# Altium schematic sheet Sche_PheriperalSchDoc.SchDoc
size A
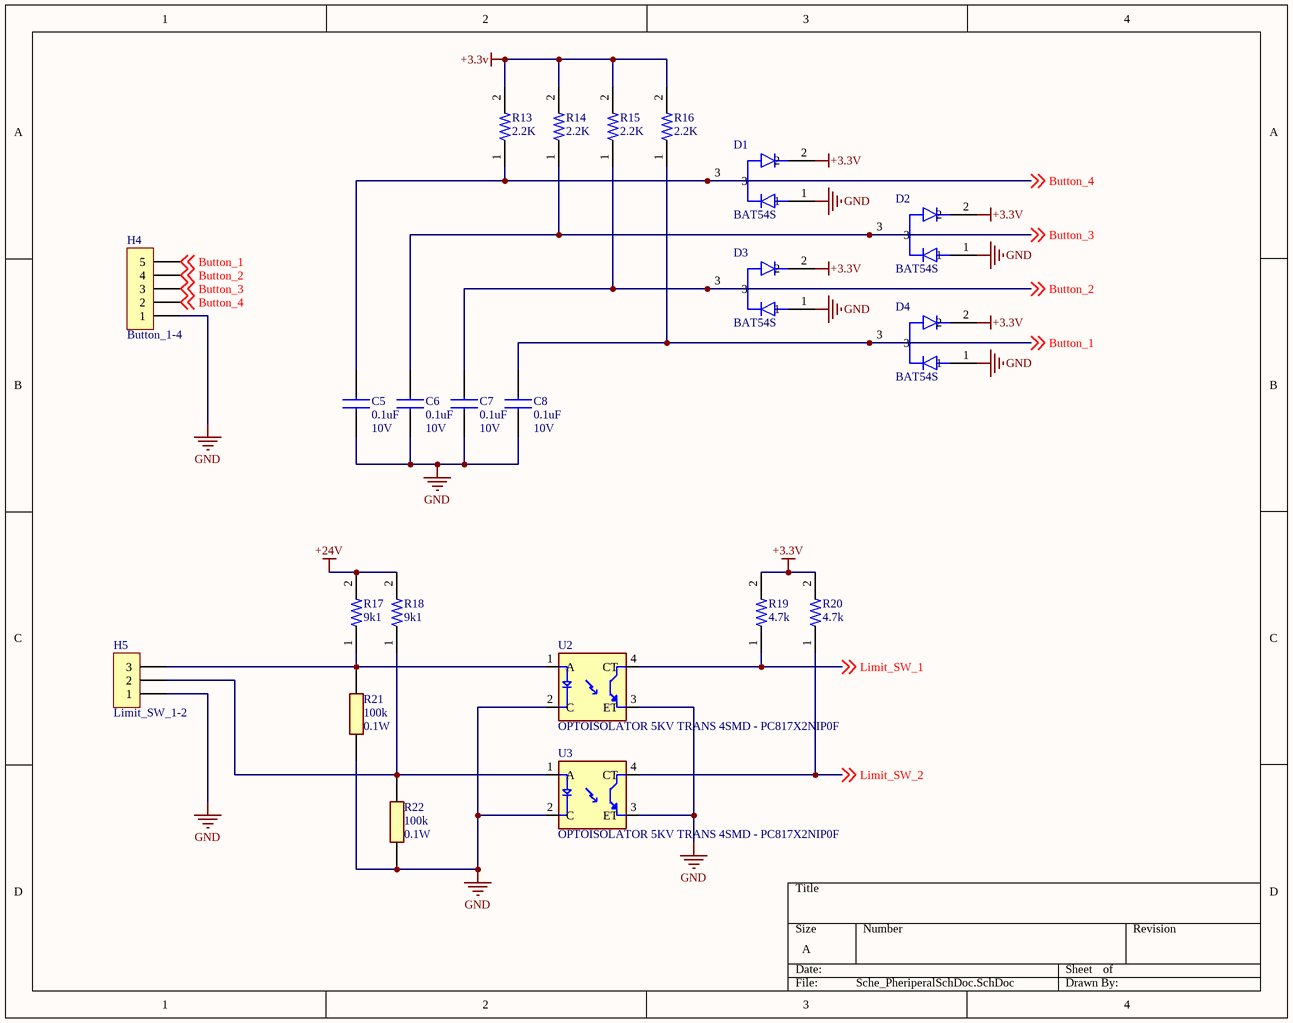
[diagram p0: Sche_PheriperalSchDoc.SchDoc]

## Parts
C5  0.1uF  [CAPC1608X95N]
C6  0.1uF  [CAPC1608X95N]
C7  0.1uF  [CAPC1608X95N]
C8  0.1uF  [CAPC1608X95N]
D1  BAT54S  [SOT95P240X120-3N]
D2  BAT54S  [SOT95P240X120-3N]
D3  BAT54S  [SOT95P240X120-3N]
D4  BAT54S  [SOT95P240X120-3N]
H4  Button_1-4  [Header 5P DC 2.54]
H5  Limit_SW_1-2  [Header 3P DC 2.54]
R13  2.2K  [RES 0805]
R14  2.2K  [RES 0805]
R15  2.2K  [RES 0805]
R16  2.2K  [RES 0805]
R17  9k1  [Res 0603]
R18  9k1  [Res 0603]
R19  4.7k  [Res 0603]
R20  4.7k  [Res 0603]
R21  100k  [ERJ2RKD1004X]
R22  100k  [ERJ2RKD1004X]
U2  OPTOISOLATOR 5KV TRANS 4SMD - PC817X2NIP0F  [SOT254P975X400-4N]
U3  OPTOISOLATOR 5KV TRANS 4SMD - PC817X2NIP0F  [SOT254P975X400-4N]

## Nets
+3.3v: D1.2 D2.2 D3.2 D4.2 R13.2 R14.2 R15.2 R16.2 R19.2 R20.2
+24V: R17.2 R18.2
GND: C5.1 C6.1 C7.1 C8.1 D1.1 D2.1 D3.1 D4.1 H4.1 H5.1 R21.1 R22.1 U2.2(C) U2.3(ET) U3.2(C) U3.3(ET)
Button_1: C8.2 D4.3 H4.5 R16.1 ; off-sheet Button_1
Button_2: C7.2 D3.3 H4.4 R15.1 ; off-sheet Button_2
Button_3: C6.2 D2.3 H4.3 R14.1 ; off-sheet Button_3
Button_4: C5.2 D1.3 H4.2 R13.1 ; off-sheet Button_4
Limit_SW_1: R19.1 U2.4(CT) ; off-sheet Limit_SW_1
Limit_SW_2: R20.1 U3.4(CT) ; off-sheet Limit_SW_2
NetH5_2: H5.2 R18.1 R22.2 U3.1(A)
NetH5_3: H5.3 R17.1 R21.2 U2.1(A)

## Notes on the sheet
- (in symbol CAP CER 0.1UF 10V X7R 0603 - C0603C104K8RACTU) 10V
- (in symbol RES SMD 100K OHM 1% 1/10W 0402 - ERJ2RKF1003X) 0.1W

## Library data of the parts
C5-C8 = CAP CER 0.1UF 10V X7R 0603 - C0603C104K8RACTU: Multilayer Ceramic Capacitors MLCC - SMD/SMT; Manufacturer_Name: KEMET; Manufacturer_Part_Number: C0603C104K8RACTU/1K; Geometry.Height: 0.95mm; Mouser Part Number: N/A; Mouser Price/Stock: https://www.mouser.com/Search/Refine.aspx?Keyword=N%2FA; Arrow Part Number: *; Arrow Price/Stock: *; Datasheet Link: https://api.kemet.com/component-edge/download/specsheet/C0603C104K8RACTU.pdf
D1-D4 = DIODE SCHOTTKY 30V 150MA SOT23  - BAT54S: DIODE SCHOTTKY 30V 150MA SOT23; Package: None; MP: BAT54S; Value: *; Availability: Unavailable; Price: None
H4 = Header 5P 2.54 Duc Cong: Cắm; Ten_Linh_Kien: Header 5P XH2.54-5P Đực Cong; Don_Vi: Con; Ma_Hang: MH001308; Chung_Loai: Cắm
H5 = Header 3P 2.54 Duc Cong: Cắm; Ten_Linh_Kien: Header 3P XH2.54-3P Đực Cong; Don_Vi: Con; Ma_Hang: MH001302; Chung_Loai: Cắm
R13-R16 = RES SMD 2.2K OHM 5% 1/2W 0805 - ERJ-P06J222V: RES SMD 2.2K OHM 5% 1/2W 0805; MF: PANASONIC; MP: ERJ-P06J222V
R17 R18 = RES SMD 9.1K OHM 1% 1/10W 0603 - ERJ-3EKF9101V: RES SMD 9.1K OHM 1% 1/10W 0603; MF: Panasonic; MP: ERJ-3EKF9101V
R19 R20 = RES 4.7K OHM 1% 1/10W 0603 - RC0603FR-074K7L: RES 4.7K OHM 1% 1/10W 0603; MF: Yageo; Value: *; SnapEDA_Link: https://www.snapeda.com/parts/RC0603FR-074K7L/Yageo/view-part/473520/?ref=snap; MP: RC0603FR-074K7L; Availability: Unavailable; Price: None; Package: 0603 Yageo
R21 R22 = RES SMD 100K OHM 1% 1/10W 0402 - ERJ2RKF1003X: RES SMD 100K OHM 1% 1/10W 0402; Manufacturer_Name: Panasonic; Geometry.Height: 0.4mm; Manufacturer_Part_Number: ERJ2RKF1003X; Mouser Part Number: *; Mouser Price/Stock: *; Arrow Part Number: *; Arrow Price/Stock: *; Datasheet Link: http://docs-europe.electrocomponents.com/webdocs/13ba/0900766b813ba21b.pdf
U2 U3 = OPTOISOLATOR 5KV TRANS 4SMD - PC817X2NIP0F: Optoisolator Transistor Output 5000Vrms 1 Channel 4-SMD; MF: Sharp Microelectronics; Value: *; SnapEDA_Link: https://www.snapeda.com/parts/PC817X2NIP0F/Sharp+Microelectronics/view-part/?ref=snap; Purchase-URL: https://pricing.snapeda.com/search/part/PC817X2NIP0F/?ref=eda; Check_prices: https://www.snapeda.com/parts/PC817X2NIP0F/Sharp+Microelectronics/view-part/?ref=eda; Digi-Key_Part_Number: 425-2192-2-ND; Package: SMD-4 Sharp; MP: PC817X2NIP0F